# Altium schematic sheet HAT_ID02_IMU.SchDoc
size A3; PageSetup: Record=PageOptions|CenterHorizontal=True|CenterVertical=True|PrintScale=0.71|XCorrection=1.00|YCorrection=1.00|PrintKind=1|BorderSize=5000000|LeftOffset=0|BottomOffset=0|Orientation=2|PaperLength=1000|PaperWidth=1000|Scale=100|PaperSource=7|PrintQuality=600|MediaType=1|DitherType=10|PrintScaleMode=1|PaperKind=A4 (210 x 297mm)|PaperIndex=9
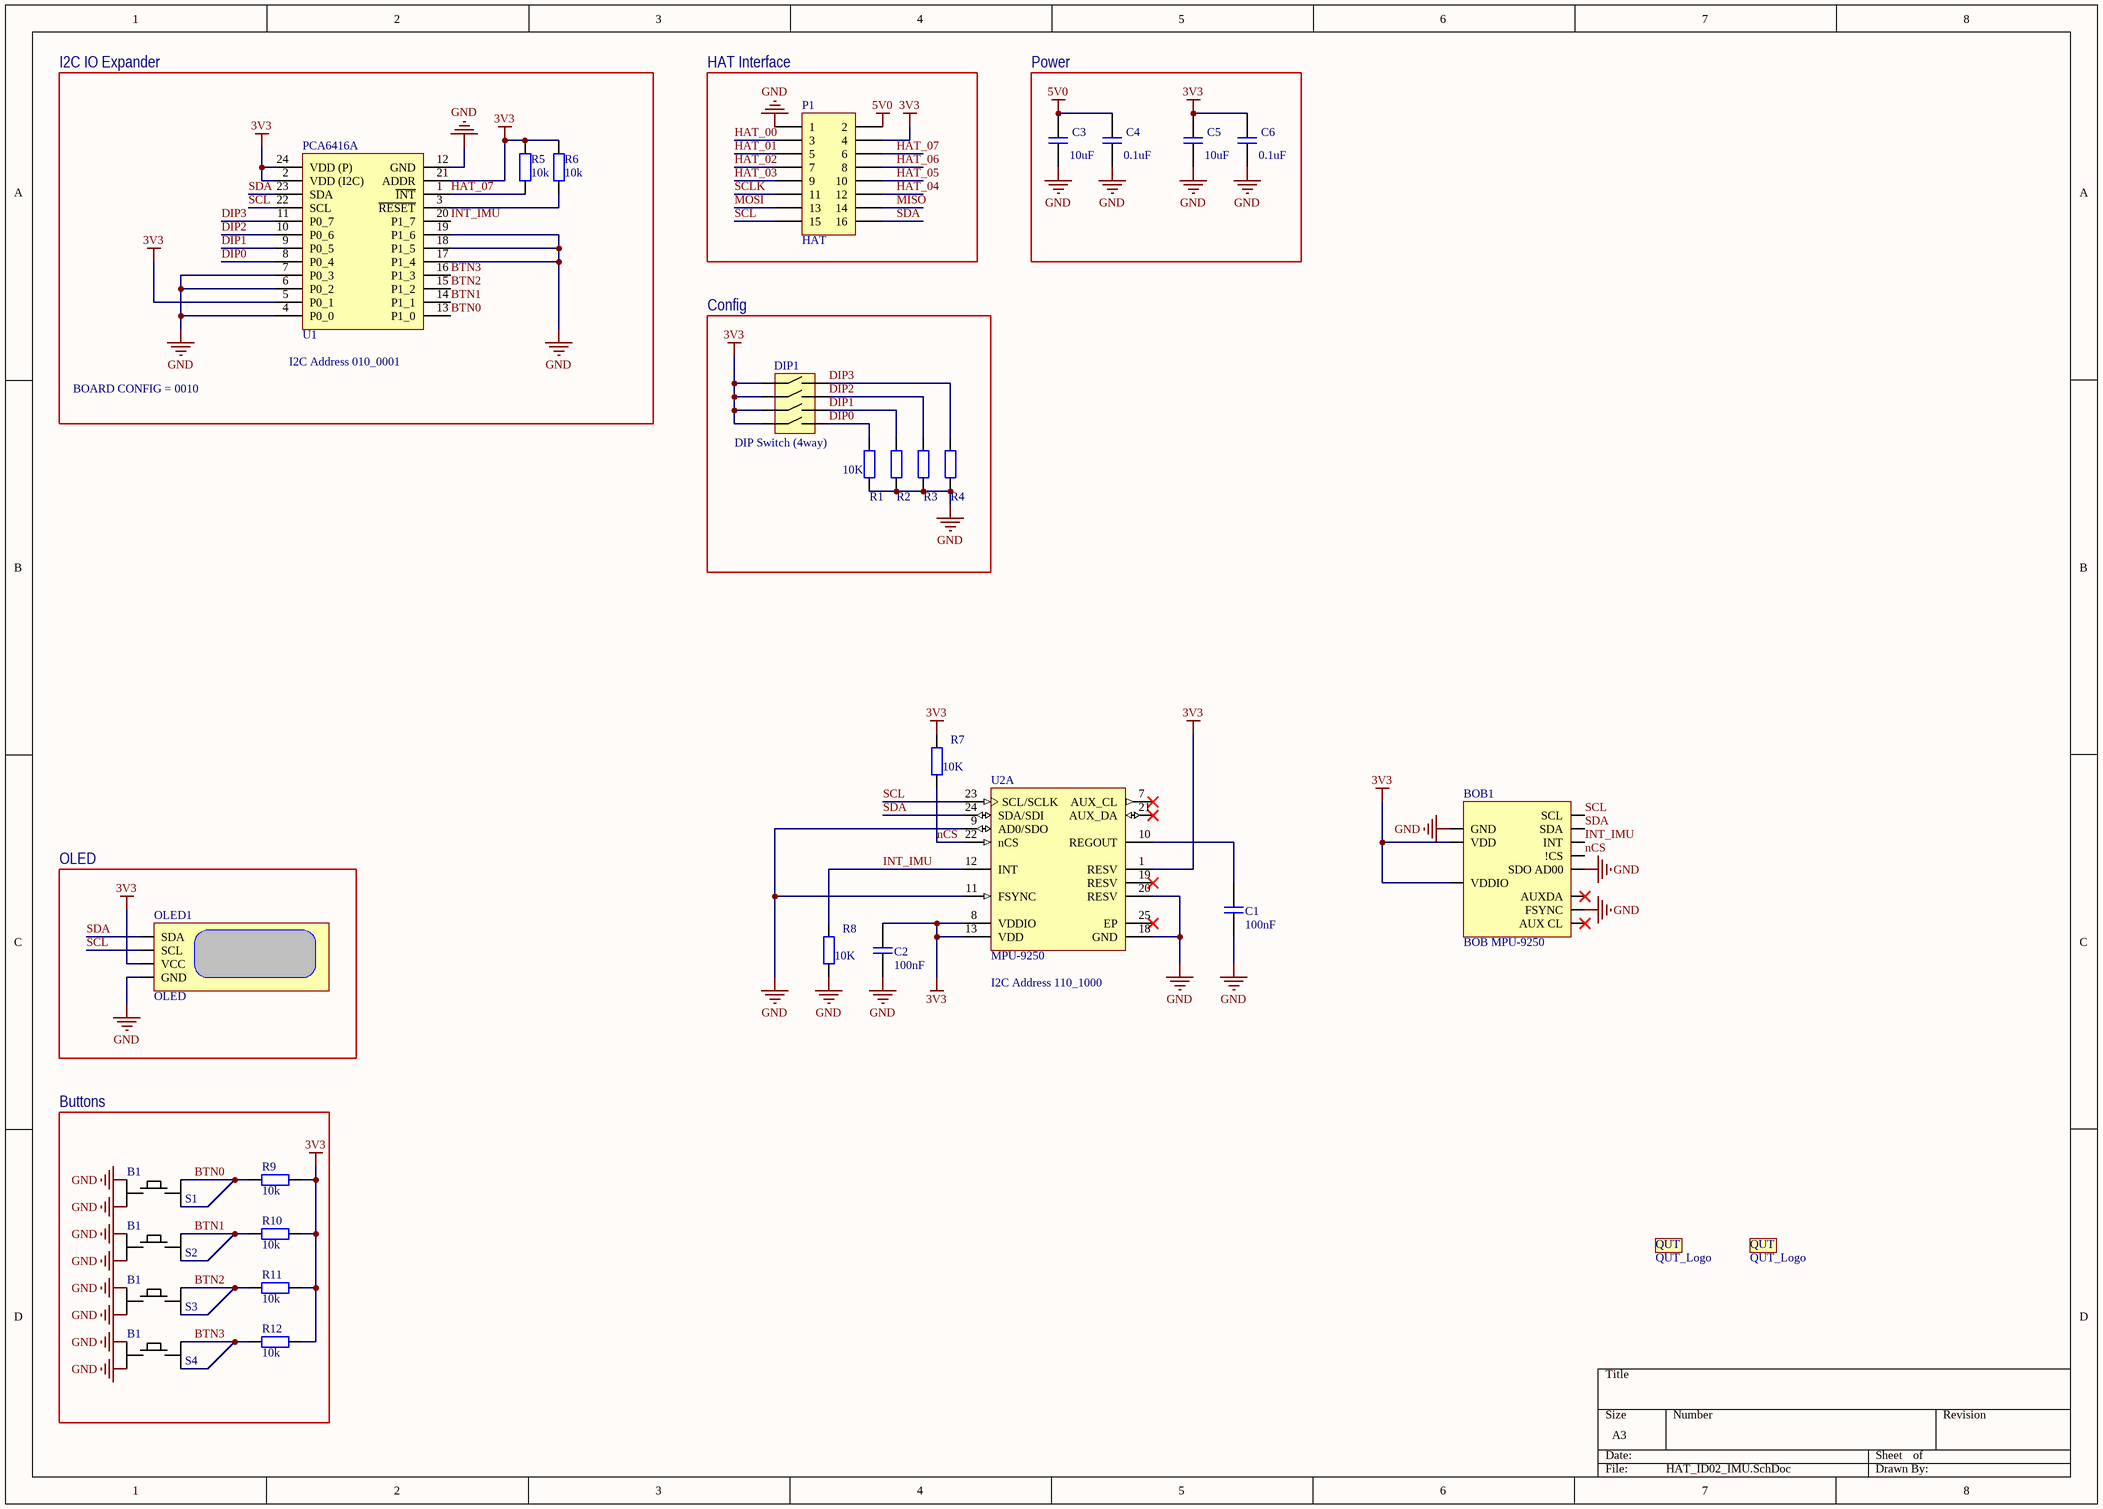
[diagram p0: HAT_ID02_IMU.SchDoc]

## Parts
BOB1  BOB MPU-9250  [BOB MPU-9250]
C1  value 100nF  [CAPC2012X07N]  (hidden comment: CAP SMD)
C2  value 100nF  [CAPC2012X07N]  (hidden comment: CAP SMD)
C3  value 10uF  [C0805]  (hidden comment: CAP SMD)
C4  value 0.1uF  [C0805]  (hidden comment: CAP SMD)
C5  value 10uF  [C0805]  (hidden comment: CAP SMD)
C6  value 0.1uF  [C0805]  (hidden comment: CAP SMD)
DIP1  DIP Switch (4way)  [DIP SMD]
LG1  QUT_Logo  [QUT_Logo]  (no BOM)
LG2  QUT_Logo  [QUT_Logo]  (no BOM)
OLED1  OLED  [OLED]
P1  HAT  [HDR2X8]
R1  value 10K  [RESC2012X07N]  (hidden comment: RES SMD)
R2  RES SMD  [RESC2012X07N]  (value not drawn)
R3  RES SMD  [RESC2012X07N]  (value not drawn)
R4  RES SMD  [RESC2012X07N]  (value not drawn)
R5  value 10k  [RESC2012X07N]  (hidden comment: RES SMD)
R6  value 10k  [RESC2012X07N]  (hidden comment: RES SMD)
R7  value 10K  [RESC2012X07N]  (hidden comment: RES SMD)
R8  value 10K  [RESC2012X07N]  (hidden comment: RES SMD)
R9  value 10k  [RESC2012X07N]  (hidden comment: RES SMD)
R10  value 10k  [RESC2012X07N]  (hidden comment: RES SMD)
R11  value 10k  [RESC2012X07N]  (hidden comment: RES SMD)
R12  value 10k  [RESC2012X07N]  (hidden comment: RES SMD)
S1  B1  [E-SWITCH-TL3342]
S2  B1  [E-SWITCH-TL3342]
S3  B1  [E-SWITCH-TL3342]
S4  B1  [E-SWITCH-TL3342]
U1  PCA6416A  [TSOP65P640X110-24N]
U2  MPU-9250  [INSE-QFN-24-1700X1540TP_M]  (part A of 2)

## Blocks framed on the sheet
I2C IO Expander: R5 R6 U1
HAT Interface: P1
Power: C3-C6
Config: DIP1 R1-R4
OLED: OLED1
Buttons: R9-R12 S1-S4

## Nets
3V3: BOB1.2(VDD) BOB1.10(VDDIO) C2.2(K) C5.2(K) C6.2(K) DIP1.0 DIP1.1 DIP1.2 DIP1.3 OLED1.2(VCC) P1.4 R5.2 R6.2 R7.2 R9.1 R10.1 R11.1 R12.1 U1.2(VDD_(I2C)) U1.5(P0_1) U1.21(ADDR) U1.24(VDD_(P)) U2.1(RESV) U2.8(VDDIO) U2.13(VDD)
5V0: C3.2(K) C4.2(K) P1.2
GND: BOB1.3(GND) BOB1.5(FSYNC) BOB1.9(SDO_AD00) C1.1(A) C2.1(A) C3.1(A) C4.1(A) C5.1(A) C6.1(A) OLED1.1(GND) P1.1 R1.1 R2.1 R3.1 R4.1 R8.1 S1.1(A) S1.2(A') S2.1(A) S2.2(A') S3.1(A) S3.2(A') S4.1(A) S4.2(A') U1.4(P0_0) U1.6(P0_2) U1.7(P0_3) U1.12(GND) U1.17(P1_4) U1.18(P1_5) U1.19(P1_6) U2.9(AD0/SDO) U2.11(FSYNC) U2.18(GND) U2.20(RESV)
BTN0: R9.2 S1.3(B') S1.4(B) U1.13(P1_0)
BTN1: R10.2 S2.3(B') S2.4(B) U1.14(P1_1)
BTN2: R11.2 S3.3(B') S3.4(B) U1.15(P1_2)
BTN3: R12.2 S4.3(B') S4.4(B) U1.16(P1_3)
DIP0: DIP1.4 R1.2 U1.8(P0_4)
DIP1: DIP1.5 R2.2 U1.9(P0_5)
DIP2: DIP1.6 R3.2 U1.10(P0_6)
DIP3: DIP1.7 R4.2 U1.11(P0_7)
HAT_00: P1.3
HAT_01: P1.5
HAT_02: P1.7
HAT_03: P1.9
HAT_04: P1.12
HAT_05: P1.10
HAT_06: P1.8
HAT_07: P1.6 R5.1 U1.1(~{INT})
INT_IMU: BOB1.7(INT) R8.2 U1.20(P1_7) U2.12(INT)
MISO: P1.14
MOSI: P1.13
nCS: BOB1.8(!CS) R7.1 U2.22(nCS)
SCL: BOB1.0(SCL) OLED1.3(SCL) P1.15 U1.22(SCL) U2.23(SCL/SCLK)
SCLK: P1.11
SDA: BOB1.1(SDA) OLED1.4(SDA) P1.16 U1.23(SDA) U2.24(SDA/SDI)
NetC1_2: C1.2(K) U2.10(REGOUT)
NetR6_1: R6.1 U1.3(~{RESET})

Not connected (* = marked no-connect by the designer): BOB1 4(AUXDA)* 6(AUX_CL)*; U2 7(AUX_CL)* 19(RESV)* 21(AUX_DA)* 25(EP)*

## Notes on the sheet
- (near U1) I2C Address 010_0001
- BOARD CONFIG = 0010
- (near U2) I2C Address 110_1000
- (in symbol QUT_Logo) QUT

## Library data of the parts
C1-C6 = CAP SMD: Surface mount capacitor
P1 = Header 8X2: Header, 8-Pin, Dual row; LatestRevisionDate: 17-Jul-2002; LatestRevisionNote: Re-released for DXP Platform.; Publisher: Altium Limited
R1 R5-R12 = RES SMD: 0805 surface mount resistor
R2-R4 = RES SMD: 0805 surface mount resistor; Value: 10K
S1-S4 = E-SWITCH-PUSHBUTTON: TL 3342 surface mount pushbutton
U1 = PCA6416APW: Low-voltage translating 16-bit I2C I/O port expander
U2 = CMP-2100-03657-1: 9-axis MotionTracking device, 2.4 to 3,6 V, -40 to 85 degC, 24-Pin QFN, RoHS, Tape and Reel; Manufacturer: InvenSense; Max Supply Voltage: 3.6V; Min Supply Voltage: 2.4V; Package Reference: QFN-24; Package Quantity: 1; Datasheet Version: Rev. 1.0, 01/2014; Case/Package: QFN; Package Description: 24-Pin Quad Flat No-lead Package, Body 3 x 3 mm, Pitch 0.4 mm; Datasheet URL: http://datasheet.octopart.com/MPU-9250-InvenSense-datasheet-21859386.pdf; RoHSCompliant: true; Max Operating Temperature: 85degC; Height: 1mm; Mount: SurfaceMount; Manufacturer URL: http://www.invensense.com/; Width: 3.1mm; Min Operating Temperature: -40degC; Length: 3.1mm